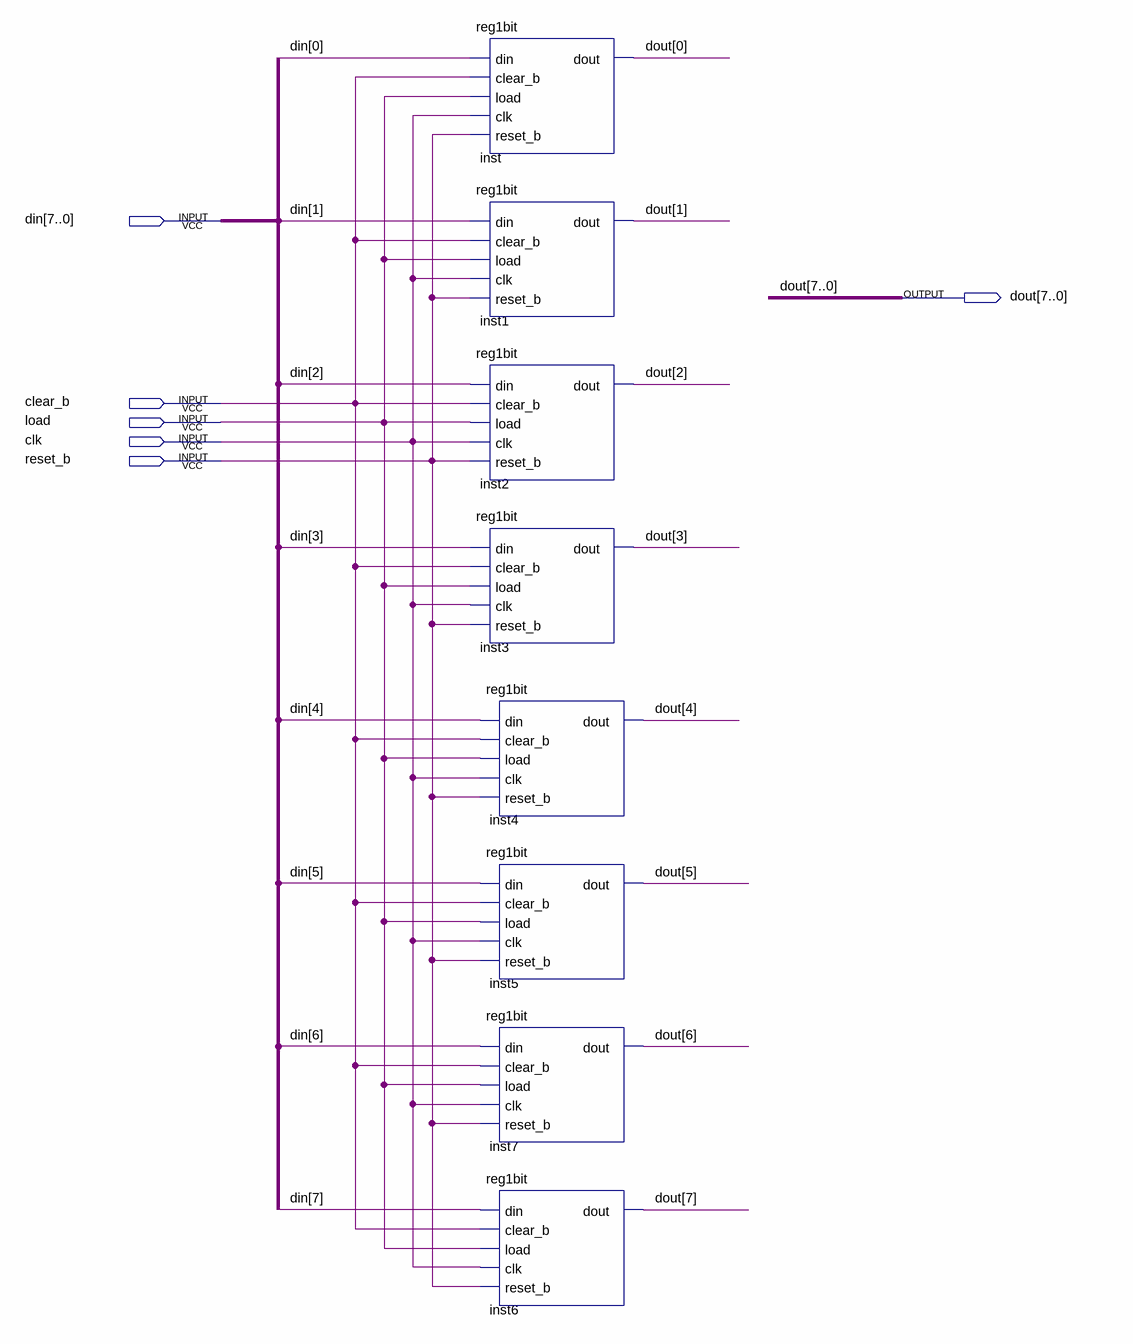
[diagram p0: schematic sheet]
// Quartus schematic reg8bit.bdf as structural Verilog: 8 symbols, 6 pins
module reg8bit (
  input  [7:0] din,
  input  clear_b,
  input  load,
  input  clk,
  input  reset_b,
  output [7:0] dout
);

  reg1bit inst (.din(din[0]), .clear_b(clear_b), .load(load), .clk(clk), .reset_b(reset_b), .dout(dout[0]));
  reg1bit inst1 (.din(din[1]), .clear_b(clear_b), .load(load), .clk(clk), .reset_b(reset_b), .dout(dout[1]));
  reg1bit inst2 (.din(din[2]), .clear_b(clear_b), .load(load), .clk(clk), .reset_b(reset_b), .dout(dout[2]));
  reg1bit inst3 (.din(din[3]), .clear_b(clear_b), .load(load), .clk(clk), .reset_b(reset_b), .dout(dout[3]));
  reg1bit inst4 (.din(din[4]), .clear_b(clear_b), .load(load), .clk(clk), .reset_b(reset_b), .dout(dout[4]));
  reg1bit inst5 (.din(din[5]), .clear_b(clear_b), .load(load), .clk(clk), .reset_b(reset_b), .dout(dout[5]));
  reg1bit inst7 (.din(din[6]), .clear_b(clear_b), .load(load), .clk(clk), .reset_b(reset_b), .dout(dout[6]));
  reg1bit inst6 (.din(din[7]), .clear_b(clear_b), .load(load), .clk(clk), .reset_b(reset_b), .dout(dout[7]));
endmodule
